# EasyEDA Pro project esp32 gpio board_7f3a0bd8d1424bb1b772e89a51e6b4df.eprj

# Schematic esp32 gpio board
Board Name: esp32 gpio board; Create Date: 2026-04-28; Page Name: Sheet_1; Project Name: esp32 gpio board_7f3a0bd8d1424bb1b772e89a51e6b4df; Schematic Name: esp32 gpio board; Update Date: 2026-04-28; Company: EasyEDA.com; Page Size: A4; Version: V1.0
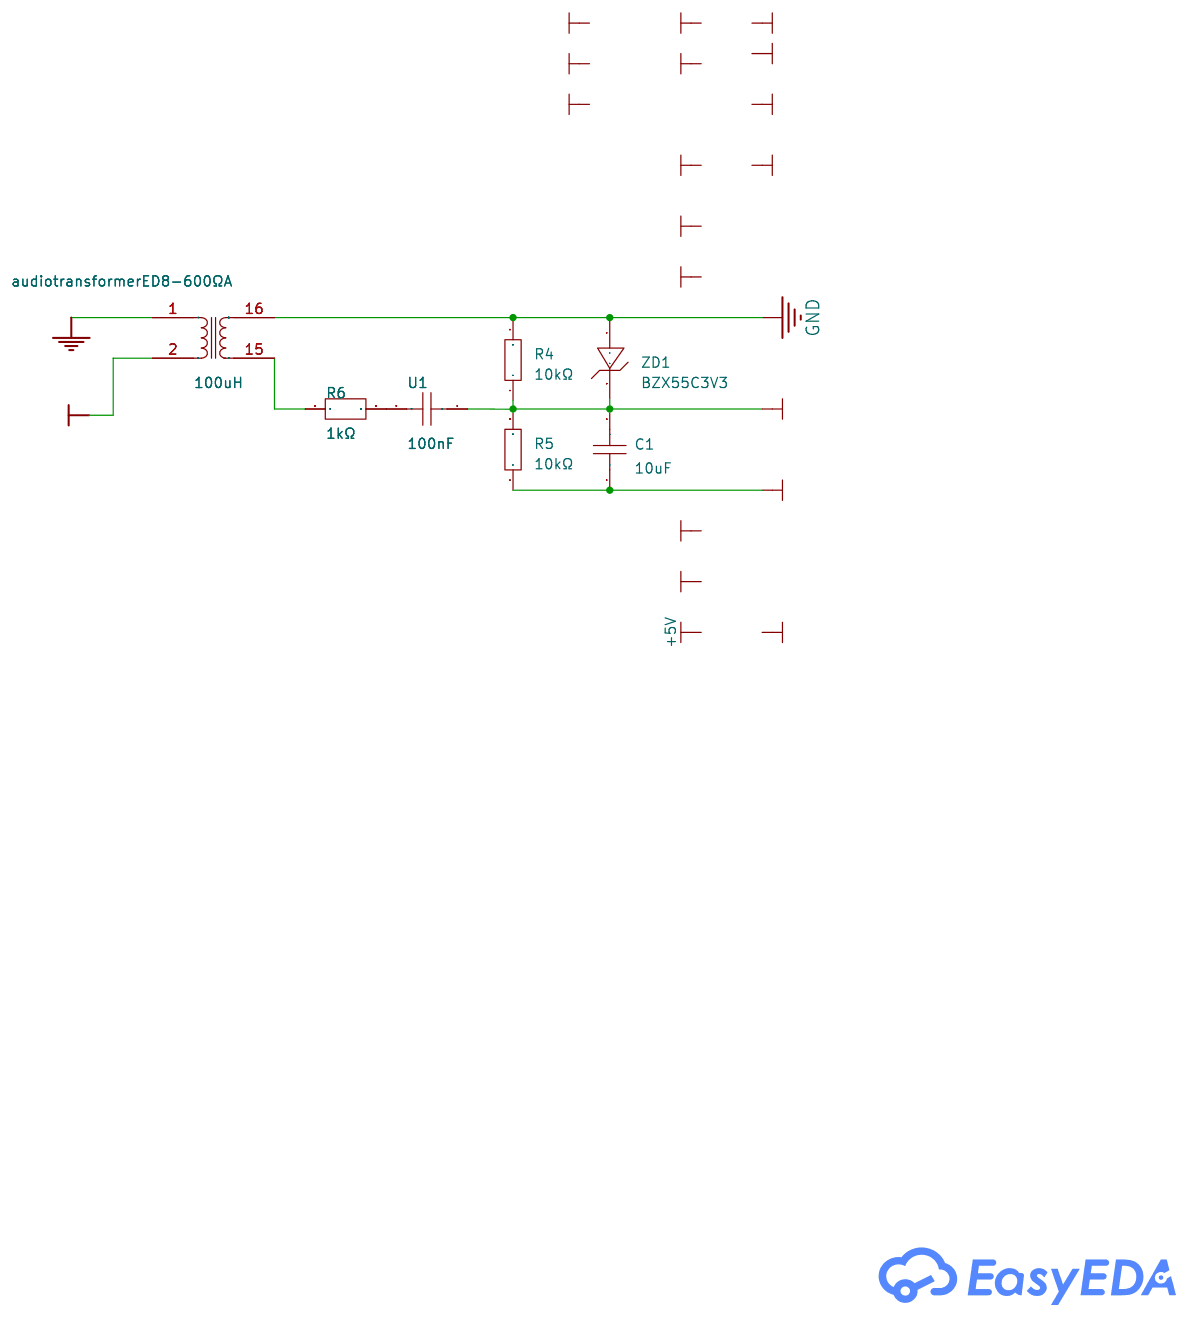
[diagram p0: schematic sheet]

## Parts
audiotransformerED8-600Ω  100uH  [XFMR-SMD_16P-L12.8-W7.1-P1.27-LS9.5-BL]  (section 1)
C1  10uF  [CAP-TH_L5.9-W4.2-P5.08-D0.5]
R4  10kΩ  [RES-TH_BD3.3-L9.0-P13.00-D0.6]
R5  10kΩ  [RES-TH_BD3.3-L9.0-P13.00-D0.6]
R6  1kΩ  [RES-TH_BD4.5-L11.5-P15.50-D0.7]
U1  100nF  [CAP-TH_L5.0-W2.5-P5.00-D1.0]
ZD1  BZX55C3V3  [DO-35_BD2.0-L4.0-P8.00-D0.5-FD]

## Library data of the parts
audiotransformerED8-600Ω = PE-65728NL: LCSC Part Name: 以太网隔离变压器; Supplier Part: C5707994; Manufacturer: PULSE(普思); JLCPCB Part Class: Extended Part; Datasheet: https://item.szlcsc.com/datasheet/PE-65728NL/6631160.html; Supplier: LCSC; Isolation Voltage(Vrms): 2kV; operating temperature: 0℃~+70℃
C1 = CT4G-1210-X5R-50V-10uF-K: LCSC Part Name: 10uF ±10% 50V; Supplier Part: C454406; Manufacturer: TORCH(火炬); Supplier Footprint: 插件,P=5.08mm; JLCPCB Part Class: Extended Part; Datasheet: https://item.szlcsc.com/datasheet/CT4G-1210-X5R-50V-10uF-K/456513.html; Supplier: LCSC; Tolerance: ±10%; Voltage Rating: 50V; Temperature Coefficient: X5R; Pin Spacing: 5.08mm
R4 R5 = RN1/2W10KΩFT/BA1: LCSC Part Name: 10kΩ ±1% 500mW 金属膜电阻; Supplier Part: C385563; Manufacturer: Tyohm(幸亚电阻); Supplier Footprint: 插件,D3.3xL9.2mm; JLCPCB Part Class: Extended Part; Datasheet: https://item.szlcsc.com/datasheet/RN1%252F2W10K%25CE%25A9FT%252FBA1/359410.html; Supplier: LCSC; Type: Metal Film Resistor; Tolerance: ±1%; Voltage-Supply(Max): 350V; Power(Watts): 500mW; Temperature Coefficient: ±50ppm/℃
R6 = MF2WS-1KΩ±1%T: LCSC Part Name: 金属膜电阻 1kΩ ±1% 2W; Supplier Part: C714140; Manufacturer: 华星机电; Supplier Footprint: 插件,D4.5xL11.5mm; JLCPCB Part Class: Extended Part; Datasheet: https://atta.szlcsc.com/upload/public/pdf/source/20200731/C713882_AE8EB1102749D7E4FB4FB13DC898C429.pdf; Supplier: LCSC; Type: Metal Film Resistors; Tolerance: ±1%; Power(Watts): 2W; Temperature Coefficient: ±200ppm/℃
U1 = 100nF: Supplier Part: C9900015256; JLCPCB Part Class: Extended Part; Supplier: LCSC
ZD1 = BZX55C3V3: LCSC Part Name: 硅平面齐纳二极管; Supplier Part: C2507; Manufacturer: ST(先科); Supplier Footprint: DO-35; JLCPCB Part Class: Extended Part; Datasheet: https://item.szlcsc.com/datasheet/BZX55C3V3/2884.html; Supplier: LCSC; Diode Configuration: Independent; Zener Voltage(Nom): 3.3V; Reverse Leakage Current (Ir): 2uA@1V; Zener Voltage(Range): 3.1V~3.5V; Pd - Power Dissipation: 500mW; Impedance(Zzt): 85Ω; Impedance(Zzk): 600Ω

## Nets
+3.3V: C1.1 R5.1
GND: audiotransformerED8-600Ω.1 audiotransformerED8-600Ω.16 R4.2 ZD1.1(A)
AUDIO_L: audiotransformerED8-600Ω.2
GPIO_3: C1.2 R4.1 R5.2 U1.1 ZD1.2(K)
$1N1576: audiotransformerED8-600Ω.15 R6.1
$1N1589: R6.2 U1.2

# Board PCB3
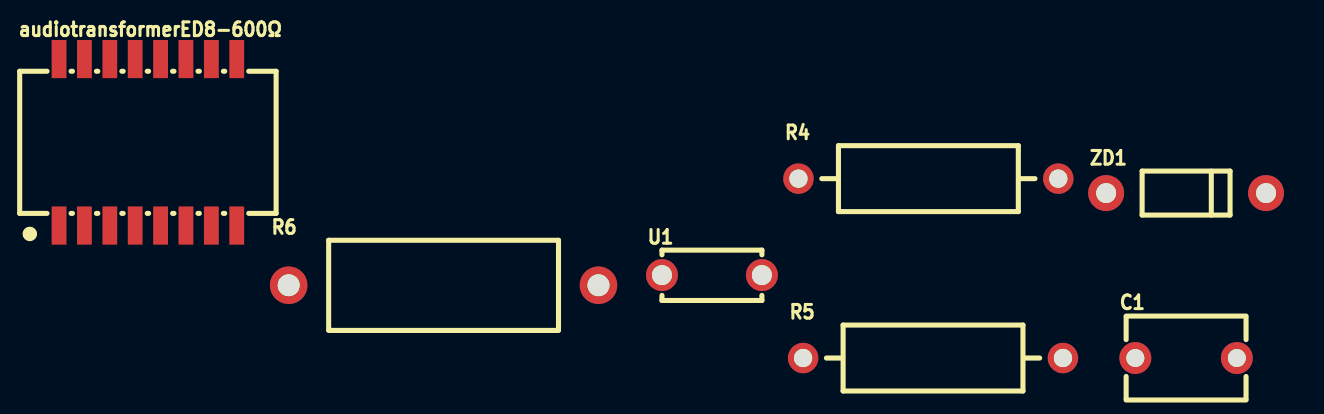
[diagram p1: board, top side]
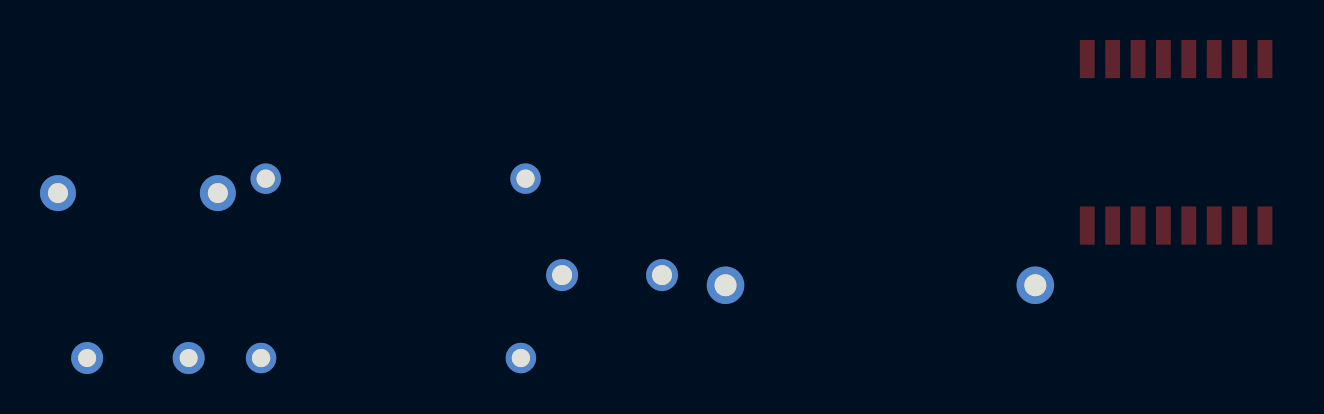
[diagram p2: board, bottom side, seen from below]

No outline. copper layers: Top Layer, Bottom Layer. Coordinates in mm from the lowest, leftmost part position.
Stack: Top Layer 0.035mm / Dielectric1 1.51mm FR4 er 4.5 / Bottom Layer 0.035mm

## Design rules (mm)
template: JLCPCB Capability(Two Layers Board)
spacing copperThickness1oz (default): track to track 0.102, other pairs 0.152 to 0.3
spacing copperThickness2oz: track to track 0.203, other pairs 0.152 to 0.3
track width copperThickness1oz (default): min 0.127, default 0.254, max 2.54
track width copperThickness2oz: min 0.203, default 0.254, max 2.54
differential pair differentialPair (default): width min 0.127, default 0.254, max 2.54; gap min 0.152, default 0.152
via viaSize (default): diameter min 0.5, default 0.61, max 10; hole min 0.3, default 0.305, max 6.3

## Placement (name value [footprint] x y rotation side)
audiotransformerED8-600Ω  100uH  [XFMR-SMD_16P-L12.8-W7.1-P1.27-LS9.5-BL]  0 10.79 0 top
C1  10uF  [CAP-TH_L5.9-W4.2-P5.08-D0.5]  51.95 0 0 top
R4  10kΩ  [RES-TH_BD3.3-L9.0-P13.00-D0.6]  39.05 8.98 0 top
R5  10kΩ  [RES-TH_BD3.3-L9.0-P13.00-D0.6]  39.28 0 0 top
R6  1kΩ  [RES-TH_BD4.5-L11.5-P15.50-D0.7]  14.79 3.64 0 top
U1  100nF  [CAP-TH_L5.0-W2.5-P5.00-D1.0]  28.22 4.15 0 top
ZD1  BZX55C3V3  [DO-35_BD2.0-L4.0-P8.00-D0.5-FD]  51.95 8.25 0 top

## Footprints (pads in the part's own frame, mm; a bottom-side part is the same pattern mirrored in y, then rotated)
CAP-TH_L5.0-W2.5-P5.00-D1.0
  round 1.6 hole 1: 1(-2.5,0) 2(2.5,0)
CAP-TH_L5.9-W4.2-P5.08-D0.5
  round 1.6 hole 0.9: 1(-2.54,0) 2(2.54,0)
DO-35_BD2.0-L4.0-P8.00-D0.5-FD
  round 1.8 hole 1: 1(-4,0) 2(4,0)
RES-TH_BD3.3-L9.0-P13.00-D0.6
  round 1.524 hole 0.914: 1(-6.5,0) 2(6.5,0)
RES-TH_BD4.5-L11.5-P15.50-D0.7
  round 1.879 hole 1.1: 1(-7.75,0) 2(7.75,0)
XFMR-SMD_16P-L12.8-W7.1-P1.27-LS9.5-BL
  rect 0.74x1.91 smd: 1(-4.445,-4.165) 2(-3.175,-4.165) 3(-1.905,-4.165) 4(-0.635,-4.165) 5(0.635,-4.165) 6(1.905,-4.165) 7(3.175,-4.165) 8(4.445,-4.165) 9(4.445,4.165) 10(3.175,4.165) 11(1.905,4.165) 12(0.635,4.165) 13(-0.635,4.165) 14(-1.905,4.165) 15(-3.175,4.165) 16(-4.445,4.165)

## Nets
As in the schematic, except:
GPIO3: C1.2 R4.1 R5.2 U1.1 ZD1.2

Pads without a net: audiotransformerED8-600Ω 3 4 5 6 7 8 9 10 11 12 13 14
